# Altium project 电磁模块.PrjPcb
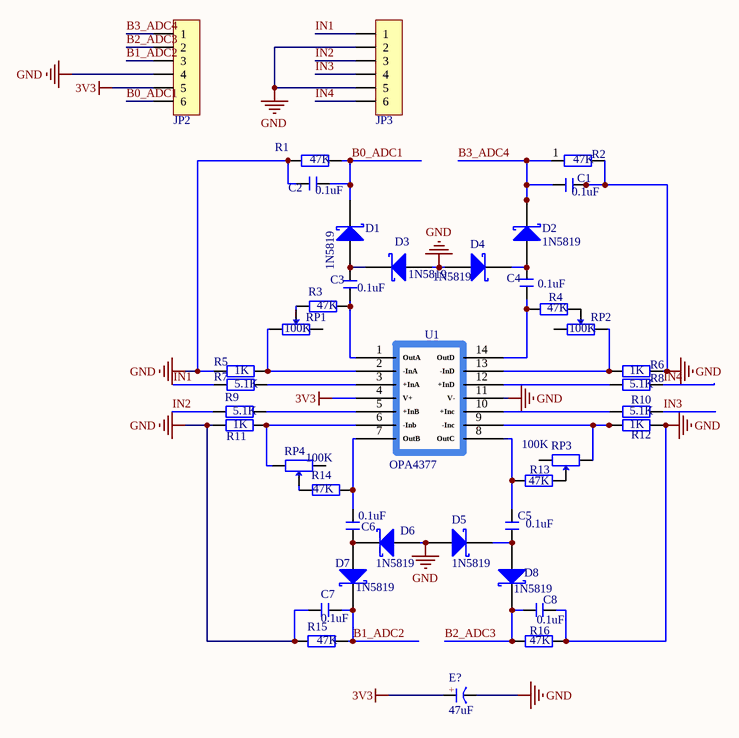
[diagram p0: 电磁模块.SchDoc]
1 sheet, 40 parts. Net scope: global (net labels, ports and power ports of the same name join across sheets).
Board file: Phoenix电磁模块.PcbDoc

## Sheet 电磁模块.SchDoc
size A4

### Parts
C1  0.1uF  [C 0805_L]
C2  0.1uF  [C 0805_L]
C3  0.1uF  [C 0805_L]
C4  0.1uF  [C 0805_L]
C5  0.1uF  [C 0805_L]
C6  0.1uF  [C 0805_L]
C7  0.1uF  [C 0805_L]
C8  0.1uF  [C 0805_L]
D1  1N5819  [SOD-323]
D2  1N5819  [SOD-323]
D3  1N5819  [SOD-323]
D4  1N5819  [SOD-323]
D5  1N5819  [SOD-323]
D6  1N5819  [SOD-323]
D7  1N5819  [SOD-323]
D8  1N5819  [SOD-323]
E?  47uF  [CD B(3528)]
JP2  HDR-1X6  [HDR2.54-LI-6P]  (value not drawn)
JP3  HDR-1X6  [HDR2.54-LI-6P]  (value not drawn)
R1  47K  [R 0805_L]
R2  47K  [R 0805_L]
R3  47K  [R 0805_L]
R4  47K  [R 0805_L]
R5  1K  [R 0805_L]
R6  1K  [R 0805_L]
R7  5.1K  [R 0805_L]
R8  5.1K  [R 0805_L]
R9  5.1K  [R 0805_L]
R10  5.1K  [R 0805_L]
R11  1K  [R 0805_L]
R12  1K  [R 0805_L]
R13  47K  [R 0805_L]
R14  47K  [R 0805_L]
R15  47K  [R 0805_L]
R16  47K  [R 0805_L]
RP1  100K  [3296W]
RP2  100K  [3296W]
RP3  100K  [3296W]
RP4  100K  [3296W]
U1  OPA4377  [TSSOP-14]

### Nets
3V3: E?.1(A) JP2.5 U1.4(V+)
GND: C1.2 C2.1 C7.2 C8.2 D3.1(A) D4.1(A) D5.1(A) D6.1(A) E?.2(K) JP2.4 JP3.2 JP3.5 R1.1 R2.2 R5.1 R6.2 R11.1 R12.2 R15.1 R16.2 U1.11(V-)
B0_ADC1: C2.2 D1.2(K) JP2.6 R1.2
B1_ADC2: C7.1 D7.2(K) JP2.3 R15.2
B2_ADC3: C8.1 D8.2(K) JP2.2 R16.1
B3_ADC4: C1.1 D2.2(K) JP2.1 R2.1
IN1: JP3.1 R7.1
IN2: JP3.3 R9.1
IN3: JP3.4 R10.2
IN4: JP3.6 R8.2
NetC3_1: C3.1 R3.2 U1.1(OutA)
NetC3_2: C3.2 D1.1(A) D3.2(K)
NetC4_1: C4.1 R4.1 U1.14(OutD)
NetC4_2: C4.2 D2.1(A) D4.2(K)
NetC5_1: C5.1 R13.1 U1.8(OutC)
NetC5_2: C5.2 D5.2(K) D8.1(A)
NetC6_1: C6.1 R14.2 U1.7(OutB)
NetC6_2: C6.2 D6.2(K) D7.1(A)
NetR3_1: R3.1 RP1.2
NetR4_2: R4.2 RP2.2
NetR5_2: R5.2 RP1.1 U1.2(-InA)
NetR6_1: R6.1 RP2.3 U1.13(-InD)
NetR7_2: R7.2 U1.3(+InA)
NetR8_1: R8.1 U1.12(+InD)
NetR9_2: R9.2 U1.5(+InB)
NetR10_1: R10.1 U1.10(+Inc)
NetR11_2: R11.2 RP4.3 U1.6(-Inb)
NetR12_1: R12.1 RP3.1 U1.9(-Inc)
NetR13_2: R13.2 RP3.2
NetR14_1: R14.1 RP4.2

Not connected (* = marked no-connect by the designer): RP1 3; RP2 1; RP3 3; RP4 1

### Notes on the sheet
- (in symbol CT) +

### Library data of the parts
C1-C8 = C: 贴片电容; BOM名称: 无极性贴片电容; 淘宝ID: 封装库来自淘宝 ID：黄晶宝石; 联系售后: https://shop463601444.taobao.com
D1-D8 = 1N5819: 肖特基二极管; 淘宝ID: 封装库来自淘宝 ID：黄晶宝石; 属性: 40V/2A; BOM名称: 肖特基二极管; 欢迎光临: https://shop463601444.taobao.com
E? = CT: 贴片钽电容; 淘宝ID: 封装库来自淘宝 ID：黄晶宝石; BOM名称: 贴片钽电容; 联系售后: https://shop463601444.taobao.com
JP2 JP3 = Header 6: 6P接插件; 版权归属: 封装库来自淘宝 ID：黄晶宝石; BOM名称: 6P接插件; 学习资源: https://shop463601444.taobao.com
R1-R16 = R: 贴片电阻; 版权归属: 来自淘宝 ID：黄晶宝石; BOM名称: 贴片电阻; 联系售后: https://shop463601444.taobao.com
RP1-RP4 = RP: 单联电位器; BOM名称: 插件电位器; 版权归属: 封装库来自淘宝 ID：黄晶宝石; 联系售后: https://shop463601444.taobao.com